# EAGLE design 130_Pad (EAGLE 9.6.2)
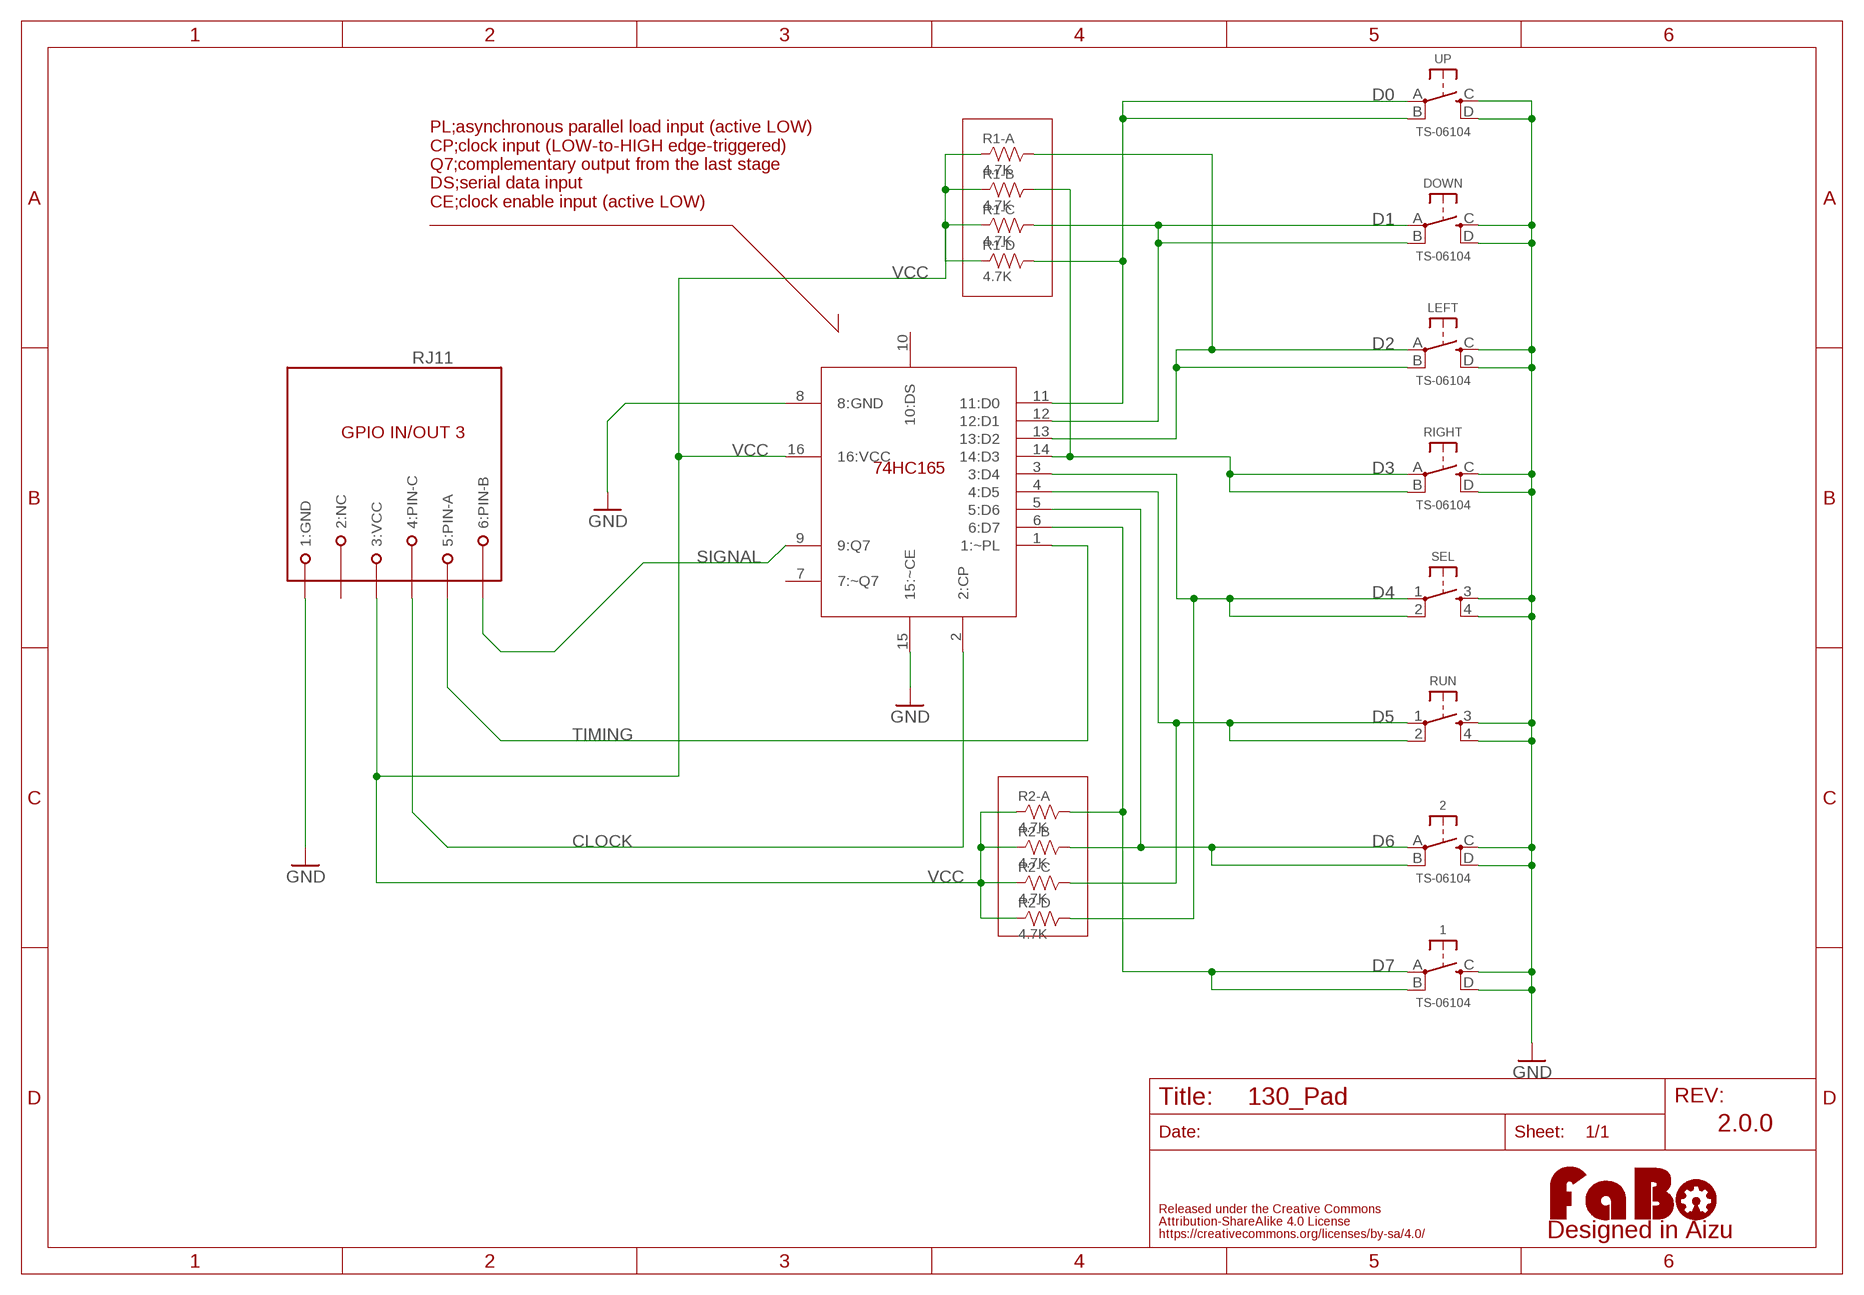
[diagram p0: schematic, sheet 1]

## Parts
1  TS-06104  [TS-06104]
2  TS-06104  [TS-06104]
DOWN  TS-06104  [TS-06104]
LEFT  TS-06104  [TS-06104]
LOGO1  LOGO_FABO-M_BOTTOM  [LOGO_FABO_M_BOTTOM]
R1  4.7K  RESISTOR_ARRAY_4  [EXBV8V]
R2  4.7K  RESISTOR_ARRAY_4  [EXBV8V]
RIGHT  TS-06104  [TS-06104]
RJ11  MODULAR-JACK-6P-RJ11_GPIO3  [7002-6PXC-X]
RUN  TACT-SWITCH-SMD_KMR2  [KMR2]
SEL  TACT-SWITCH-SMD_KMR2  [KMR2]
U$5  74HC165  [SO16]
UP  TS-06104  [TS-06104]

## Nets
CLOCK: RJ11.4(4:PIN-C) U$5.2(2:CP)
D0: R1.5 U$5.11(11:D0) UP.A UP.B
D1: DOWN.A DOWN.B R1.6 U$5.12(12:D1)
D2: LEFT.A LEFT.B R1.8 U$5.13(13:D2)
D3: R1.7 RIGHT.A RIGHT.B U$5.14(14:D3)
D4: R2.5 SEL.1 SEL.2 U$5.3(3:D4)
D5: R2.6 RUN.1 RUN.2 U$5.4(4:D5)
D6: 2.A 2.B R2.7 U$5.5(5:D6)
D7: 1.A 1.B R2.8 U$5.6(6:D7)
GND: 1.C 1.D 2.C 2.D DOWN.C DOWN.D LEFT.C LEFT.D RIGHT.C RIGHT.D RJ11.1(1:GND) RUN.3 RUN.4 SEL.3 SEL.4 U$5.8(8:GND) U$5.15(15:~CE) UP.C UP.D
SIGNAL: RJ11.6(6:PIN-B) U$5.9(9:Q7)
TIMING: RJ11.5(5:PIN-A) U$5.1(1:~PL)
VCC: R1.1 R1.2 R1.3 R1.4 R2.1 R2.2 R2.3 R2.4 RJ11.3(3:VCC) U$5.16(16:VCC)
Unconnected: RJ11.2(2:NC) U$5.7(7:~Q7) U$5.10(10:DS)

## Notes on the sheet
- PL;asynchronous parallel load input (active LOW)
  CP;clock input (LOW-to-HIGH edge-triggered)
  Q7;complementary output from the last stage
  DS;serial data input
  CE;clock enable input (active LOW)
- 2.0.0

## Library data of the parts
1 2 DOWN LEFT RIGHT UP = FaBo-Switch:TS-06104
LOGO1 = component:LOGO_FABO
R1 R2 = FaBo-Resistors:RESISTOR_ARRAY_4
RJ11 = FaBo-Connetor:MODULAR-JACK-6P-RJ11_GPIO3
RUN SEL = FaBo-Switch:TACT-SWITCH: Part No Maker Datasheet Distributor 1273HA-160G-G SWITRONIC Catalog <http://www.switronic.com/uploads/images/A10.gif> Akizuki <http://akizukidenshi.com/catalog/g/gP-02561/> DTS-6-V Cosland DTS 6 Series <http://www.cosland.com/newproduct/DTS%20SERIES.pdf> Akizuki <http://akizukidenshi.com/catalog/g/gP-03647/> KMR2 C&K KMR2 SERIES <https://www.ckswitches.com/products/switches/product-details/Tactile/KMR2/> Octoparts Result <https://octopart.com/search?q=KMR2&start=0> TSHA-T-XB2-19E TOP UP INDUSTORY TSHA-T <http://www.top-up.com.tw/front/bin/ptdetail.phtml?Part=TSHA-T> Akizuki <http://akizukidenshi.com/catalog/g/gP-09361/>
U$5 = FaBo-LogicIC:74HC165: NXP semiconductors 8-bit parallel-in/serial out shift register high-spped Si-gate CMOS device

## Board
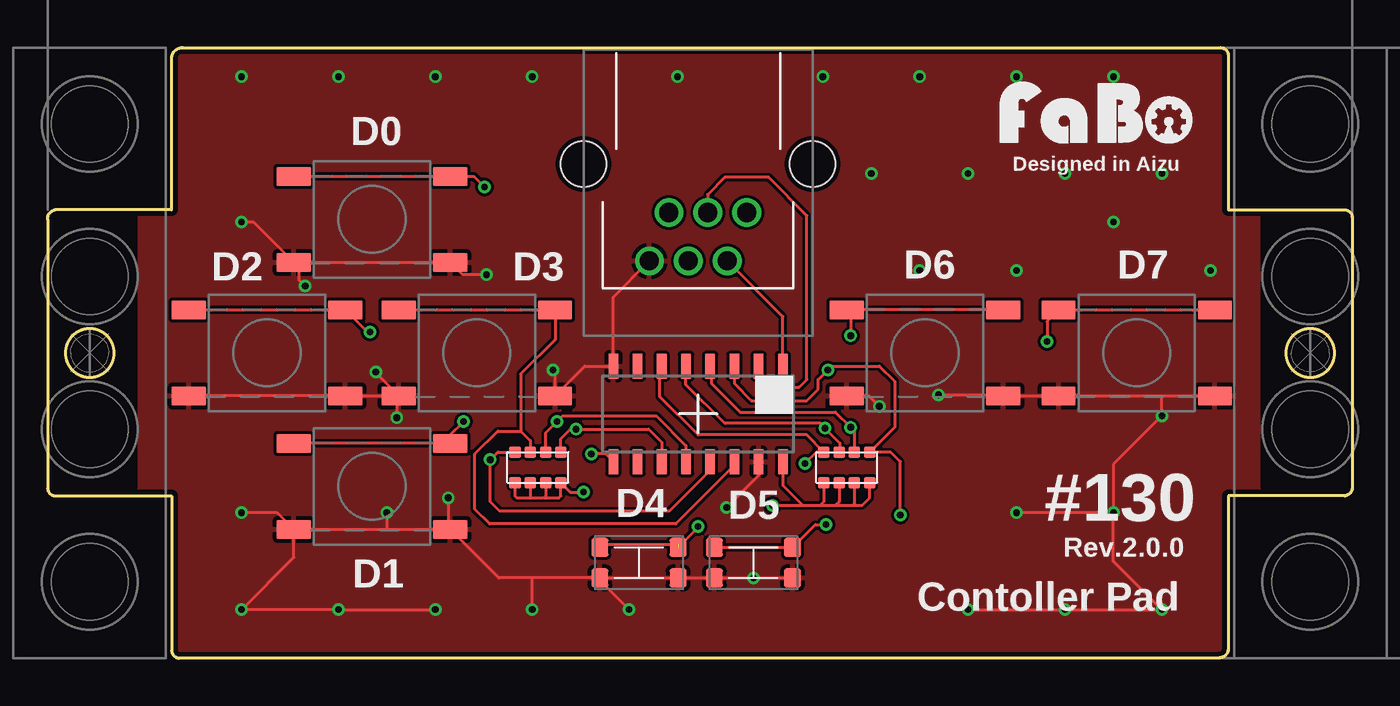
[diagram p1: board, top side]
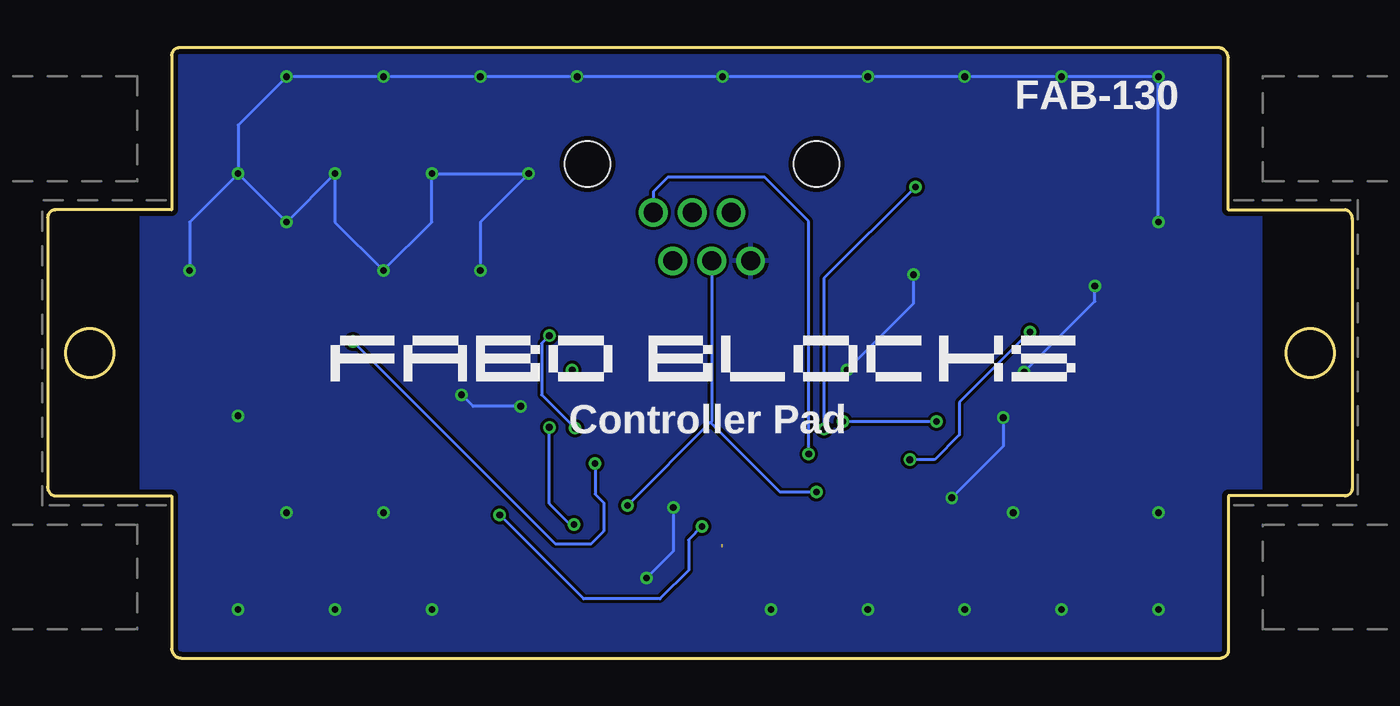
[diagram p2: board, bottom side, seen from below]

Size 68.41 x 32 mm. Coordinates in mm from the lower left corner, seen from the top.
Outline: 7.1,32 61.5,32 arc-90 61.9,31.6 61.9,23.5 68,23.5 arc-90 68.4,23.1 68.4,9 arc-90 68,8.5 61.9,8.5 61.9,0.5 arc-90 61.4,0 6.9,0 arc-90 6.5,0.4 6.5,8.5 0.4,8.5 arc-90 0,8.9 0,23 arc-90 0.4,23.5 6.5,23.5 6.5,31.5 arc-90 7.1,32
Outline: circle at 66.2,16 radius 1.27
Outline: circle at 2.2,16 radius 1.27
Copper layers (1*16): Top 0.035mm / dielectric 1.6mm / Bottom 0.035mm
Design rules "PCBway": minimum track width 6mil, minimum drill 12mil, track to track 6mil, track to pad 6mil, pad to pad 6mil, via to via 6mil, smd to smd 6mil, copper to edge 10mil, drill to drill 10mil, minimum pad ring 10mil, minimum via ring 6mil, stop-mask expansion 2mil, vias tented up to drill 100mil, thermal gap 8mil
tRestrict: area -1.2,7.3 to 4.7,24.4; area 63.6,7.5 to 69.5,24.6
bRestrict: area -1.2,7.3 to 4.7,24.4; area 63.6,7.6 to 69.5,24.7

### Footprints (pad centres in the part's own frame; a part is rotated, then mirrored left to right if it is on the bottom)
TS-06104 = smd 1.8 x 1: A 4.1,2.25; B -4.1,2.25; C 4.1,-2.25; D -4.1,-2.25
EXBV8V = smd 0.6 x 0.6: 1 -1.2,-0.8; 2 -0.4,-0.8; 3 0.4,-0.8; 4 1.2,-0.8; 5 1.2,0.8; 6 0.4,0.8; 7 -0.4,0.8; 8 -1.2,0.8
7002-6PXC-X = drill 1: 1 2.55,5.08; 2 1.53,2.54; 3 0.51,5.08; 4 -0.51,2.54; 5 -1.53,5.08; 6 -2.55,2.54 | hole 2.4: -6,0; 6,0
KMR2 = smd 0.9 x 1: 1 -2.05,0.8; 2 2.05,0.8; 3 2.05,-0.8; 4 -2.05,-0.8
SO16 = smd 0.55 x 1.3: 1 -4.445,-2.5; 2 -3.175,-2.5; 3 -1.905,-2.5; 4 -0.635,-2.5; 5 0.635,-2.5; 6 1.905,-2.5; 7 3.175,-2.5; 8 4.445,-2.5; 9 4.445,2.5; 10 3.175,2.5; 11 1.905,2.5; 12 0.635,2.5; 13 -0.635,2.5; 14 -1.905,2.5; 15 -3.175,2.5; 16 -4.445,2.5

### Placement (x,y rotation side)
1  57.1,16 0 top
2  46,16 0 top
DOWN  17,9 0 top
LEFT  11.5,16 0 top
LOGO1  54.97,26.61 0 bottom
R1  25.7,10 0 top
R2  41.9,10 0 top
RIGHT  22.5,16 0 top
RJ11  34.1,25.9 180 top
RUN  37,5 0 top
SEL  31,5 0 top
U$2  [4-1BLOCK]  2.2,16 0 top
U$4  [4-1BLOCK]  66.2,16 180 top
U$5  34.1,12.8 180 top
UP  17,23 0 top

### Tracks (layer width: path | path; a pad name or v marks a point on that pad's centre or on a via)
CLOCK
  Top 0.152: U$5.2 37.38,15.2 37.38,14.43 37.6,14.2 39.4,14.2 39.8,14.6 39.8,23.2 37.8,25.2 35.5,25.2 34.6,24.3 RJ11.4
D0  (via drill 0.35)
  Top 0.152: R1.5 26.9,11.5 27.4,12 v27.7,12 31.5,12 32.2,11.3 U$5.11 | v22.9,24.7 22.35,25.25 UP.A UP.B
  Bottom 0.152: v22.9,24.7 27.7,19.9 v27.7,12
D1  (via drill 0.35)
  Top 0.152: R1.6 26.1,11.8 v26.7,12.4 27,12.7 31.9,12.7 33.47,11.13 U$5.12 | v21.8,12.4 21.1,11.7 DOWN.A DOWN.B
  Bottom 0.152: v21.8,12.4 v26.7,12.4
D2  (via drill 0.35)
  Top 0.152: U$5.13 34.74,9.84 32.6,7.7 23.7,7.7 23.2,8.2 v23.2,10.4 23.6,10.8 R1.8 | v16.9,17.1 16.75,17.1 LEFT.A LEFT.B
  Bottom 0.152: v16.9,17.1 20.6,13.4 20.6,11.7 21.9,10.4 v23.2,10.4
D3
  Top 0.152: U$5.14 36.01,10.11 32.93,7.03 23.17,7.03 22.4,7.8 22.4,10.7 23.6,11.9 24.8,11.9 | R1.7 25.3,11.4 24.8,11.9 | 24.8,11.9 24.8,14.9 26.6,16.7 RIGHT.A RIGHT.B
D4  (via drill 0.35)  (1 unrouted)
  Top 0.152: U$5.3 36.01,14.39 36.9,13.5 39.8,13.5 40.4,14.1 40.4,14.6 v40.9,15.1 41.1,15.3 43.6,15.3 44.4,14.5 44.4,12.1 R2.5 44.2,10.8 44.7,10.3 v44.7,7.5 | SEL.1 28.96,5.97 33.06,5.97 | SEL.2 34.1,6.85 v34.1,6.9
  Bottom 0.152: v34.1,6.9 34.8,6.2 34.8,4.6 36.3,3.1 40.3,3.1 v44.7,7.5
D5  (via drill 0.35)
  Top 0.152: U$5.4 34.8,15.23 34.8,14.4 36.3,12.9 41.3,12.9 v42.1,12.1 42.3,11.9 R2.6 | RUN.1 RUN.2 40.25,7 v40.8,7
  Bottom 0.152: v40.8,7 41,7 42.1,8.1 v42.1,12.1
D6  (via drill 0.35)
  Top 0.152: U$5.5 33.47,14.34 35.5,12.3 40.5,12.3 v40.75,12.05 41.53,11.27 41.53,10.83 R2.7 | 2.A 2.B 42.1,18.05 v42.1,16.9
  Bottom 0.152: v42.1,16.9 42.5,16.5 42.5,13.8 v40.75,12.05
D7  (via drill 0.35)
  Top 0.152: U$5.6 32.1,15.21 32.1,13.7 34.1,11.7 39.8,11.7 R2.8 40.3,10.8 v39.7,10.2 | 1.A 1.B 52.4,17.65 v52.4,16.6
  Bottom 0.152: v52.4,16.6 41.8,6 39.9,6 39.25,6.65 39.25,8.15 39.7,8.6 v39.7,10.2
GND  (via drill 0.35)
  Top 0.152: RUN.3 v37,4.2 RUN.4 SEL.3 SEL.4 | 58.42,13.75 1.D 50.3,13.75 | 58.42,13.75 1.C | 2.C 50.3,13.75 | 2.D 43.05,13.75 v43.6,13.2 | v46.7,13.8 50.25,13.8 50.3,13.75 | 13.2,20.75 UP.D 10.79,22.86 v10.16,22.86 | 13.2,20.75 UP.C 21.75,20.1 v23,20.1 | RIGHT.D LEFT.C LEFT.D | DOWN.D 17.78,6.75 | 17.78,6.75 DOWN.C | RJ11.1 29.66,18.93 U$5.8 28.15,15.3 RIGHT.C 26.6,15 v26.5,15.1 | U$5.15 37.28,9.57 v35.6,7.9 | SEL.4 25.4,4.2 | 25.4,4.2 23.65,4.2 DOWN.C | RIGHT.D 18.3,13.65 v18.3,12.6 | v21,8.4 21,6.85 DOWN.C | RIGHT.D 17.2,14.95 v17.2,15 | v13.5,19.5 13.2,19.8 13.2,20.75 | DOWN.D 12.03,7.62 v10.16,7.62 | DOWN.D 12.9,5.28 v10.16,2.54 v15.24,2.54 v20.32,2.54 | v17.78,7.62 17.78,6.75 | v25.4,2.54 25.4,4.2 | v30.48,2.54 28.95,4.07 SEL.4 | v48.26,2.54 v53.34,2.54 v58.42,2.54 55.88,5.08 v55.88,7.62 | v55.88,7.62 v50.8,7.62 | v55.88,7.62 55.88,10.16 v58.42,12.7 58.42,13.75
  Bottom 0.152: v43.6,13.2 46.1,13.2 v46.7,13.8 | v35.6,7.9 35.6,5.6 v37,4.2 | v18.3,12.6 18.3,11.1 v21,8.4 | v26.5,15.1 23,18.6 v23,20.1 | v17.2,15 13.5,18.7 v13.5,19.5 | v10.16,22.86 v10.16,30.48 v15.24,30.48 v20.32,30.48 v25.4,30.48 v33.02,30.48 v40.64,30.48 v45.72,30.48 v50.8,30.48 v55.88,30.48 58.42,27.94 v58.42,25.4 | v58.42,25.4 60.96,22.86 v60.96,20.32 | v58.42,25.4 v55.88,22.86 v53.34,25.4 53.34,22.86 v50.8,20.32 48.26,22.86 v48.26,25.4 v43.18,25.4 45.72,22.86 v45.72,20.32
  pour Bottom (rank 6): -12.1,-5.1 83,-5.1 83,40 -12.1,40
  pour Top (rank 6): -9.2,-2.7 80.8,-2.7 80.8,37.3 -9.2,37.3
SIGNAL  (via drill 0.35)
  Top 0.152: U$5.9 29.26,10.7 v28.5,10.7
  Bottom 0.152: v28.5,10.7 28.5,22.9 30.8,25.2 35.9,25.2 36.65,24.45 RJ11.6
TIMING
  Top 0.152: U$5.1 38.55,17.91 RJ11.5
VCC  (via drill 0.35)
  Top 0.152: U$5.16 38.55,9.05 39.6,8 | R2.4 43.1,8.4 42.7,8 42.2,8 | 39.6,8 40.5,8 | 40.5,8 41.3,8 | 41.3,8 42.2,8 | R2.3 42.3,8.1 42.2,8 | R2.2 41.5,8.2 41.3,8 | R2.1 40.7,8.2 40.5,8 | v38,8 39.6,8 | R1.1 24.5,8.5 24.6,8.4 25.3,8.4 | 25.3,8.4 26,8.4 | 26,8.4 26.8,8.4 26.9,8.5 R1.4 27.4,8.7 v28.1,8.7 | R1.3 26.1,8.5 26,8.4 | R1.2 25.3,8.4
  Bottom 0.152: RJ11.3 33.59,12.41 33.65,12.35 | 33.65,12.35 v38,8 | v28.1,8.7 30,8.7 33.65,12.35

### Text on the board
tPlace: D0 | Designed in Aizu | D2 | D3 | D6 | D7 | D4 | D5 | #130 | Rev.2.0.0 | D1 | Contoller Pad
bPlace: FAB-130 | Controller Pad
tDocu: UP | LEFT | RIGHT | 2 | 1 | DOWN | SEL | RUN | #130_Controller_Pad Rev2.0.0 / 2022/07/30